# EAGLE design with_usb_small_smd_jmp1 (EAGLE 8.4.2)
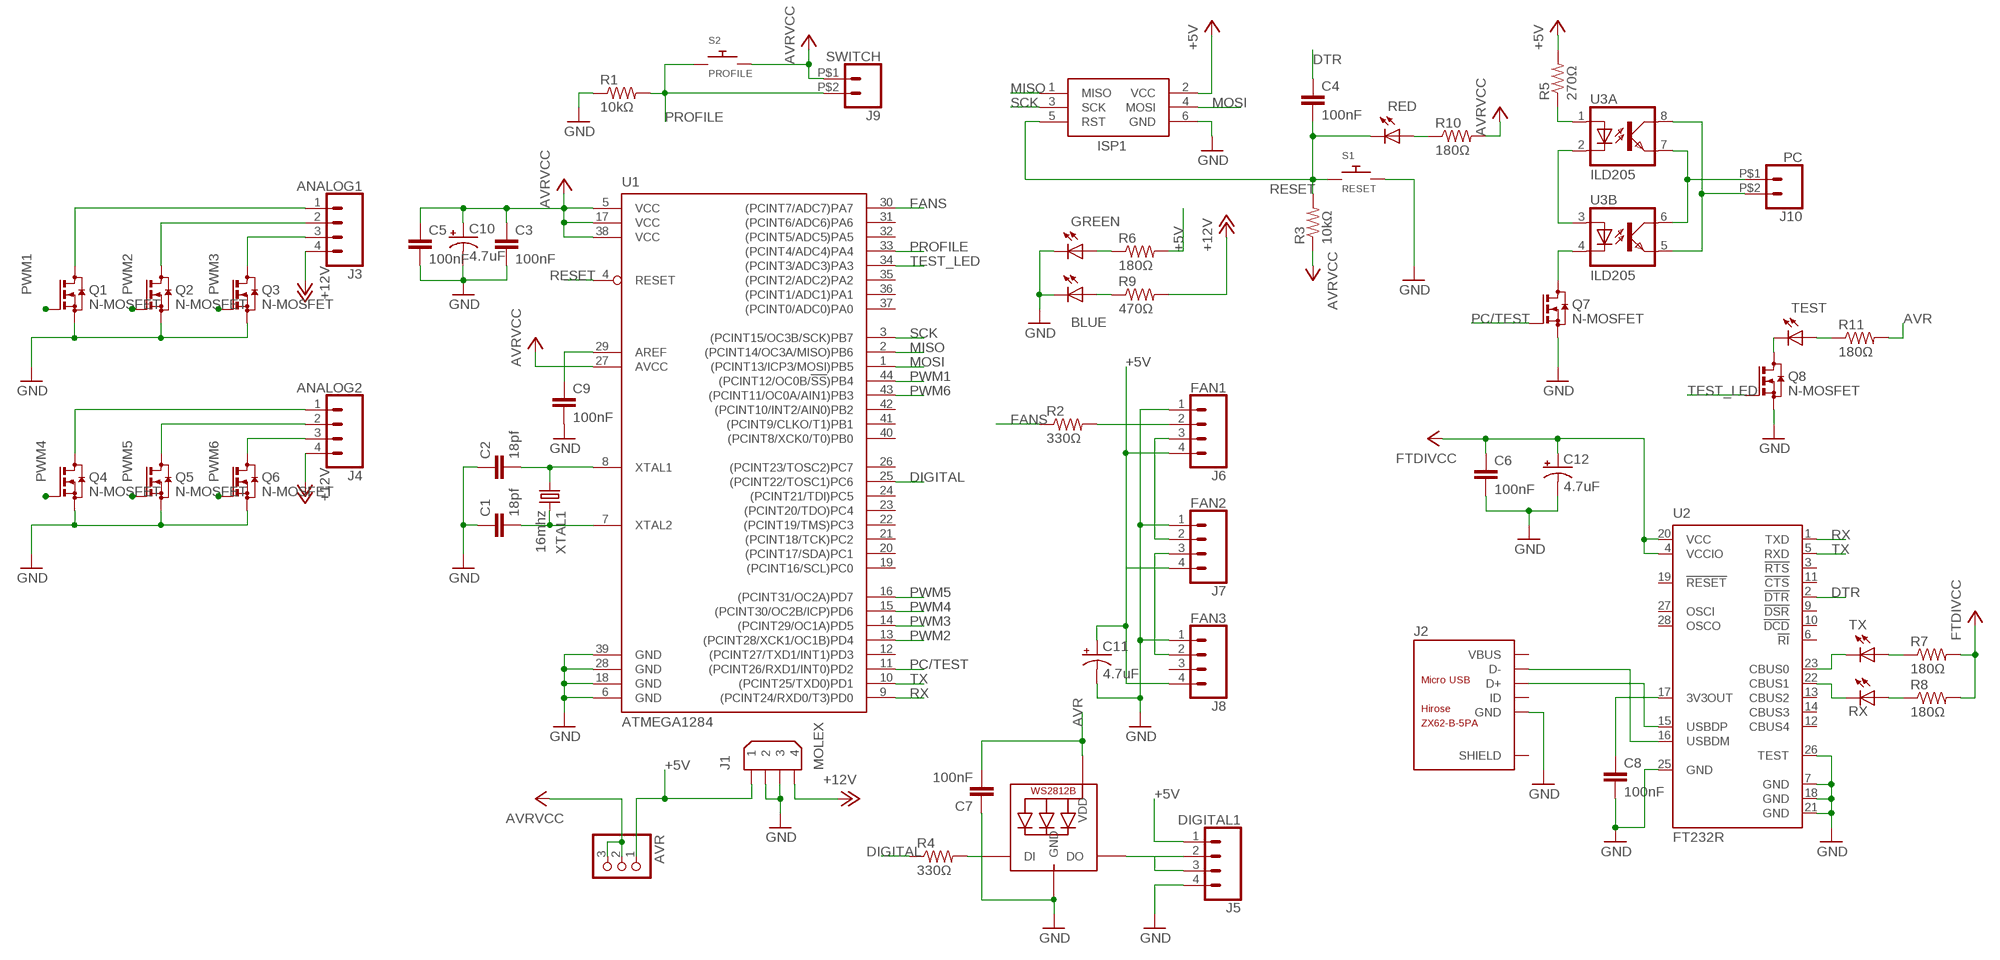
[diagram p0: schematic, sheet 1]

## Parts
AVR  PINHD-1X3  [1X03]
C1  18pf  C-EUC0805  [C0805]
C2  18pf  C-EUC0805  [C0805]
C3  100nF  C-EUC0805  [C0805]
C4  100nF  C-EUC0805  [C0805]
C5  100nF  C-EUC0805  [C0805]
C6  100nF  C-EUC0805  [C0805]
C7  100nF  C-EUC0805  [C0805]
C8  100nF  C-EUC0805  [C0805]
C9  100nF  C-EUC0805  [C0805]
C10  4.7uF  CPOL-US153CLV-0405  [153CLV-0405]
C11  4.7uF  CPOL-US153CLV-0405  [153CLV-0405]
C12  4.7uF  CPOL-US153CLV-0405  [153CLV-0405]
ISP1  AVRISP-6  [AVRISP]
J1  MOLEX  9090-4R  [9090-4R]
J2  MICRO_USB  [MICRO_USB]
J3  ANALOG1  MX-22-05-3041  [MX-22-05-3041]
J4  ANALOG2  MX-22-05-3041  [MX-22-05-3041]
J5  DIGITAL1  MX-22-05-3041  [MX-22-05-3041]
J6  FAN1  TJC8-4P  [TJC8-4P]
J7  FAN2  TJC8-4P  [TJC8-4P]
J8  FAN3  TJC8-4P  [TJC8-4P]
J9  SWITCH  MX-7395-02BG  [MX-7395-02BG]
J10  PC  MX-7395-02BG  [MX-7395-02BG]
LED1  TX  LEDSML0805  [SML0805]
LED2  RX  LEDSML0805  [SML0805]
LED3  GREEN  LEDSML0805  [SML0805]
LED4  BLUE  LEDSML0805  [SML0805]
LED5  RED  LEDSML0805  [SML0805]
LED6  TEST  LEDSML0805  [SML0805]
Q1  N-MOSFET  [SOT23]
Q2  N-MOSFET  [SOT23]
Q3  N-MOSFET  [SOT23]
Q4  N-MOSFET  [SOT23]
Q5  N-MOSFET  [SOT23]
Q6  N-MOSFET  [SOT23]
Q7  N-MOSFET  [SOT23]
Q8  N-MOSFET  [SOT23]
R1  10kΩ  R-US_R0805  [R0805]
R2  330Ω  R-US_R0805  [R0805]
R3  10kΩ  R-US_R0805  [R0805]
R4  330Ω  R-US_R0805  [R0805]
R5  270Ω  R-US_R0805  [R0805]
R6  180Ω  R-US_R0805  [R0805]
R7  180Ω  R-US_R0805  [R0805]
R8  180Ω  R-US_R0805  [R0805]
R9  470Ω  R-US_R0805  [R0805]
R10  180Ω  R-US_R0805  [R0805]
R11  180Ω  R-US_R0805  [R0805]
RGB  WS2812B  [WS2812B]
S1  RESET  BUTTON  [B3F-1000]
S2  PROFILE  BUTTON  [B3F-1000]
U1  ATMEGA1284  ATMEGA1284P-AU  [TQFP44]
U2  FT232R  FT232RL  [SSOP28]
U3  ILD205  [SOIC08]
XTAL1  16mhz  CRYSTALHC49U-V  [HC49U-V]

## Nets
+3V3: C8.1 U2.17(3V3OUT)
+5V: AVR.1 C6.1 C11.+ C12.+ J1.1 J5.1 J6.4 J7.4 J8.4 R5.2 R6.2 R7.2 R8.2 U2.4(VCCIO) U2.20(VCC) ; supply symbol labelled FTDIVCC
+12V: J1.4 J3.4 J4.4 R9.2
AVR: AVR.2 AVR.3 C3.1 C5.1 C7.2 C10.+ ISP1.2(VCC) J9.P$1 R3.1 R10.2 R11.2 RGB.1-VDD(VDD) S2.3 S2.4 U1.5(VCC) U1.17(VCC) U1.27(AVCC) U1.38(VCC) ; supply symbol labelled AVRVCC, +5V
D+: J2.D+ U2.15(USBDP)
D-: J2.D- U2.16(USBDM)
DIGITAL: R4.1 U1.25((PCINT22/TOSC1)PC6)
DIN-D: J5.2 J5.3 RGB.2-DOUT(DO)
DTR: C4.1 U2.2(!DTR)
F1-DIN: J6.2 R2.2
F2-DIN: J6.3 J7.2
F3-DIN: J7.3 J8.2
FANS: R2.1 U1.30((PCINT7/ADC7)PA7)
GND: C1.1 C2.1 C3.2 C5.2 C6.2 C7.1 C8.2 C9.2 C10.- C11.- C12.- ISP1.6(GND) J1.2 J1.3 J2.GND J5.4 J6.1 J7.1 J8.1 LED3.C LED4.C Q1.2(S) Q2.2(S) Q3.2(S) Q4.2(S) Q5.2(S) Q6.2(S) Q7.2(S) Q8.2(S) R1.1 RGB.3-GND(GND) S1.3 S1.4 U1.6(GND) U1.18(GND) U1.28(GND) U1.39(GND) U2.7(GND) U2.18(GND) U2.21(GND) U2.25(GND) U2.26(TEST)
LED-5V: LED3.A R6.1
LED-12V: LED4.A R9.1
LED-IN: R4.2 RGB.4-DIN(DI)
MISO: ISP1.1(MISO) U1.2((PCINT14/OC3A/MISO)PB6)
MOSI: ISP1.4(MOSI) U1.1((PCINT13/ICP3/MOSI)PB5)
N$2: LED1.A R7.1
N$3: LED5.A R10.1
N$4: LED2.A R8.1
N$5: LED6.C Q8.3(D)
N$6: C9.1 U1.29(AREF)
N$7: LED6.A R11.1
N$8: R5.1 U3.1(A:A)
N$11: U3.2(A:C) U3.3(B:A)
N$13: Q7.3(D) U3.4(B:C)
PC1: J10.P$2 U3.5(B:EMIT) U3.8(A:COL)
PC2: J10.P$1 U3.6(B:COL) U3.7(A:EMIT)
PC/TEST: Q7.1(G) U1.11((PCINT26/RXD1/INT0)PD2)
PROFILE: J9.P$2 R1.2 S2.1 S2.2 U1.33((PCINT4/ADC4)PA4)
PWM1: Q1.1(G) U1.44((PCINT12/OC0B/!SS!)PB4)
PWM2: Q2.1(G) U1.13((PCINT28/XCK1/OC1B)PD4)
PWM3: Q3.1(G) U1.14((PCINT29/OC1A)PD5)
PWM4: Q4.1(G) U1.15((PCINT30/OC2B/ICP)PD6)
PWM5: Q5.1(G) U1.16((PCINT31/OC2A)PD7)
PWM6: Q6.1(G) U1.43((PCINT11/OC0A/AIN1)PB3)
RESET: C4.2 ISP1.5(RST) LED5.C R3.2 S1.1 S1.2 U1.4(RESET)
RX: U1.9((PCINT24/RXD0/T3)PD0) U2.1(TXD)
RXLED: LED2.C U2.22(CBUS1)
S1-1: J3.1 Q1.3(D)
S1-2: J3.2 Q2.3(D)
S1-3: J3.3 Q3.3(D)
S2-1: J4.1 Q4.3(D)
S2-2: J4.2 Q5.3(D)
S2-3: J4.3 Q6.3(D)
SCK: ISP1.3(SCK) U1.3((PCINT15/OC3B/SCK)PB7)
TEST_LED: Q8.1(G) U1.34((PCINT3/ADC3)PA3)
TX: U1.10((PCINT25/TXD0)PD1) U2.5(RXD)
TXLED: LED1.C U2.23(CBUS0)
XTAL1: C2.2 U1.8(XTAL1) XTAL1.1
XTAL2: C1.2 U1.7(XTAL2) XTAL1.2
Unconnected: J2.ID J2.S1(SHIELD) J2.S2(SHIELD) J2.VCC(VBUS) J8.3 U1.12((PCINT27/TXD1/INT1)PD3) U1.19((PCINT16/SCL)PC0) U1.20((PCINT17/SDA)PC1) U1.21((PCINT18/TCK)PC2) U1.22((PCINT19/TMS)PC3) U1.23((PCINT20/TDO)PC4) U1.24((PCINT21/TDI)PC5) U1.26((PCINT23/TOSC2)PC7) U1.31((PCINT6/ADC6)PA6) U1.32((PCINT5/ADC5)PA5) U1.35((PCINT2/ADC2)PA2) U1.36((PCINT1/ADC1)PA1) U1.37((PCINT0/ADC0)PA0) U1.40((PCINT8/XCK0/T0)PB0) U1.41((PCINT9/CLKO/T1)PB1) U1.42((PCINT10/INT2/AIN0)PB2) U2.3(!RTS) U2.6(!RI) U2.9(!DSR) U2.10(!DCD) U2.11(!CTS) U2.12(CBUS4) U2.13(CBUS2) U2.14(CBUS3) U2.19(!RESET) U2.27(OSCI) U2.28(OSCO)

## Library data of the parts
AVR = my_parts:PINHD-1X3: PIN HEADER
C1 C4 = rcl:C-EU: CAPACITOR, European symbol
C2 C3 C5-C9 = resistor:C-EU: CAPACITOR, European symbol; SPICEPREFIX: C
C10-C12 = resistor:CPOL-US: POLARIZED CAPACITOR, American symbol; SPICEPREFIX: C
ISP1 = my_parts:AVRISP: AVR ISP HEADER Standard 6 pin header for AVR programming; SPICEPREFIX: X
J1 = con-thomas-betts:9090-4: Disk Drive Power four position Source: Thomas & Betts Electronic Interconnects Eiropean Edition 1998; OC_FARNELL: unknown; OC_NEWARK: unknown
J2 = my_parts:MICRO_USB
J3-J5 = my_parts:MX-22-05-3041
J6 = my_parts:TJC8-4P; SPICEPREFIX: X
J7 J8 = my_parts:TJC8-4P
J9 J10 = my_parts:MX-7395-02BG
LED1-LED6 = led:LED: LED OSRAM: - CHIPLED LG R971, LG N971, LY N971, LG Q971, LY Q971, LO R971, LY R971 LH N974, LH R974 LS Q976, LO Q976, LY Q976 LO Q996 - Hyper CHIPLED LW Q18S LB Q993, LB Q99A, LB R99A - SideLED LS A670, LO A670, LY A670, LG A670, LP A670 LB A673, LV A673, LT A673, LW A673 LH A674 LY A675 LS A676, LA A676, LO A676, LY A676, LW A676 LS A679, LY A679, LG A679 - Hyper Micro SIDELED® LS Y876, LA Y876, LO Y876, LY Y876 LT Y87S - SmartLED LW L88C, LW L88S LB L89C, LB L89S, LG L890 LS L89K, LO L89K, LY L89K LS L896, LA L896, LO L896, LY L896 - TOPLED LS T670, LO T670, LY T670, LG T670, LP T670 LSG T670, LSP T670, LSY T670, LOP T670, LYG T670 LG T671, LOG T671, LSG T671 LB T673, LV T673, LT T673, LW T673 LH T674 LS T676, LA T676, LO T676, LY T676, LB T676, LH T676, LSB T676, LW T676 LB T67C, LV T67C, LT T67C, LS T67K, LO T67K, LY T67K, LW E67C LS E67B, LA E67B, LO E67B, LY E67B, LB E67C, LV E67C, LT E67C LW T67C LS T679, LY T679, LG T679 LS T770, LO T770, LY T770, LG T770, LP T770 LB T773, LV T773, LT T773, LW T773 LH T774 LS E675, LA E675, LY E675, LS T675 LS T776, LA T776, LO T776, LY T776, LB T776 LHGB T686 LT T68C, LB T68C - Hyper Mini TOPLED® LB M676 - Mini TOPLED Santana® LG M470 LS M47K, LO M47K, LY M47K Source: http://www.osram.convergy.de LUXEON: - LUMILED® LXK2-PW12-R00, LXK2-PW12-S00, LXK2-PW14-U00, LXK2-PW14-V00 LXK2-PM12-R00, LXK2-PM12-S00, LXK2-PM14-U00 LXK2-PE12-Q00, LXK2-PE12-R00, LXK2-PE12-S00, LXK2-PE14-T00, LXK2-PE14-U00 LXK2-PB12-K00, LXK2-PB12-L00, LXK2-PB12-M00, LXK2-PB14-N00, LXK2-PB14-P00, LXK2-PB14-Q00 LXK2-PR12-L00, LXK2-PR12-M00, LXK2-PR14-Q00, LXK2-PR14-R00 LXK2-PD12-Q00, LXK2-PD12-R00, LXK2-PD12-S00 LXK2-PH12-R00, LXK2-PH12-S00 LXK2-PL12-P00, LXK2-PL12-Q00, LXK2-PL12-R00 Source: www.luxeon.com KINGBRIGHT: KA-3528ASYC Source: www.kingbright.com
Q1 Q4-Q8 = my_parts:N-MOSFET
Q2 = my_parts:N-MOSFET; SPICEPREFIX: Q
Q3 = my_parts:N-MOSFET; SPICEPREFIX: M
R1-R11 = resistor:R-US_: RESISTOR, American symbol; SPICEPREFIX: R
RGB = my_parts:WS2812B
S1 = my_parts:BUTTON; SPICEPREFIX: B
S2 = my_parts:BUTTON
U1 = my_parts:ATMEGA1284P-AU; SPICEPREFIX: X
U2 = ftdichip:FT232R: Source: http://www.ftdichip.com/Documents/DataSheets/DS_FT232R_v104.pdf; MPN: FT232RL; OC_FARNELL: 1146032; OC_NEWARK: 91K9918
U3 = optocoupler:ILD2*: Siemens ILD205/206/207/211/213/217 DUAL PHOTOTRANSISTOR SMALL OUTLINE SURFACE MOUNT OPTOCOUPLER Source: 153385-da-01-en-Optocoupler_ILD205-T.pdf; MF: VISHAY/TELEFUNKEN; MPN: ILD205T; OC_FARNELL: 1469512; OC_NEWARK: 20H8678; SPICEPREFIX: O
XTAL1 = adafruit:CRYSTAL: CRYSTAL; OC_FARNELL: 1666969; OC_NEWARK: unknown; SPICEPREFIX: X

## Net classes
0 default: clearance 0.152 mm
1 GND: clearance 0.61 mm

## Board
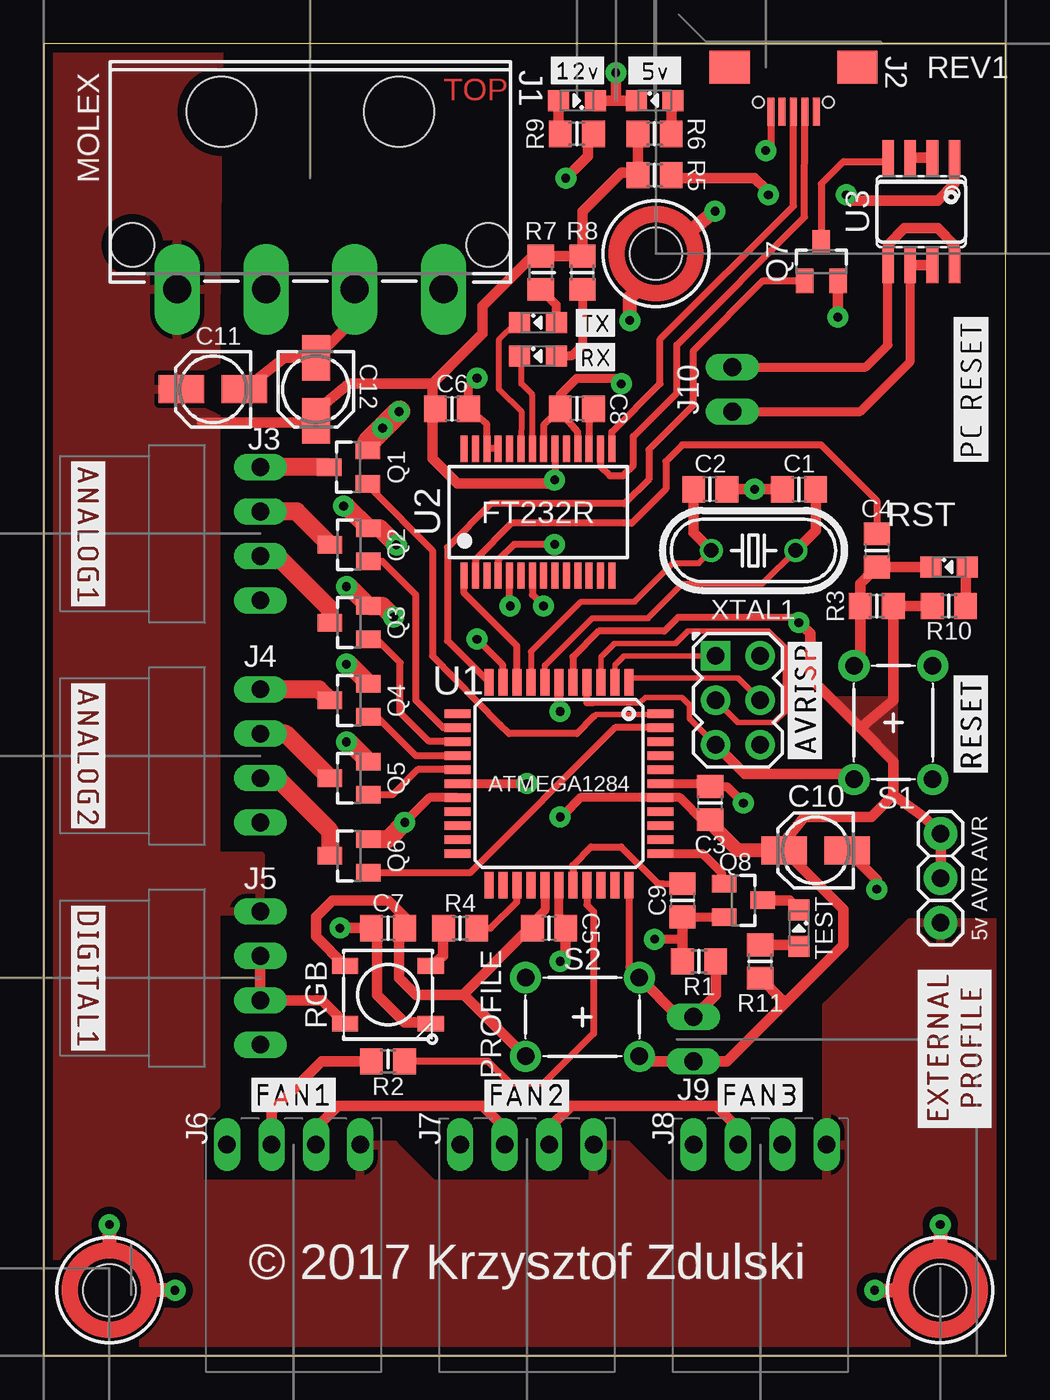
[diagram p1: board, top side]
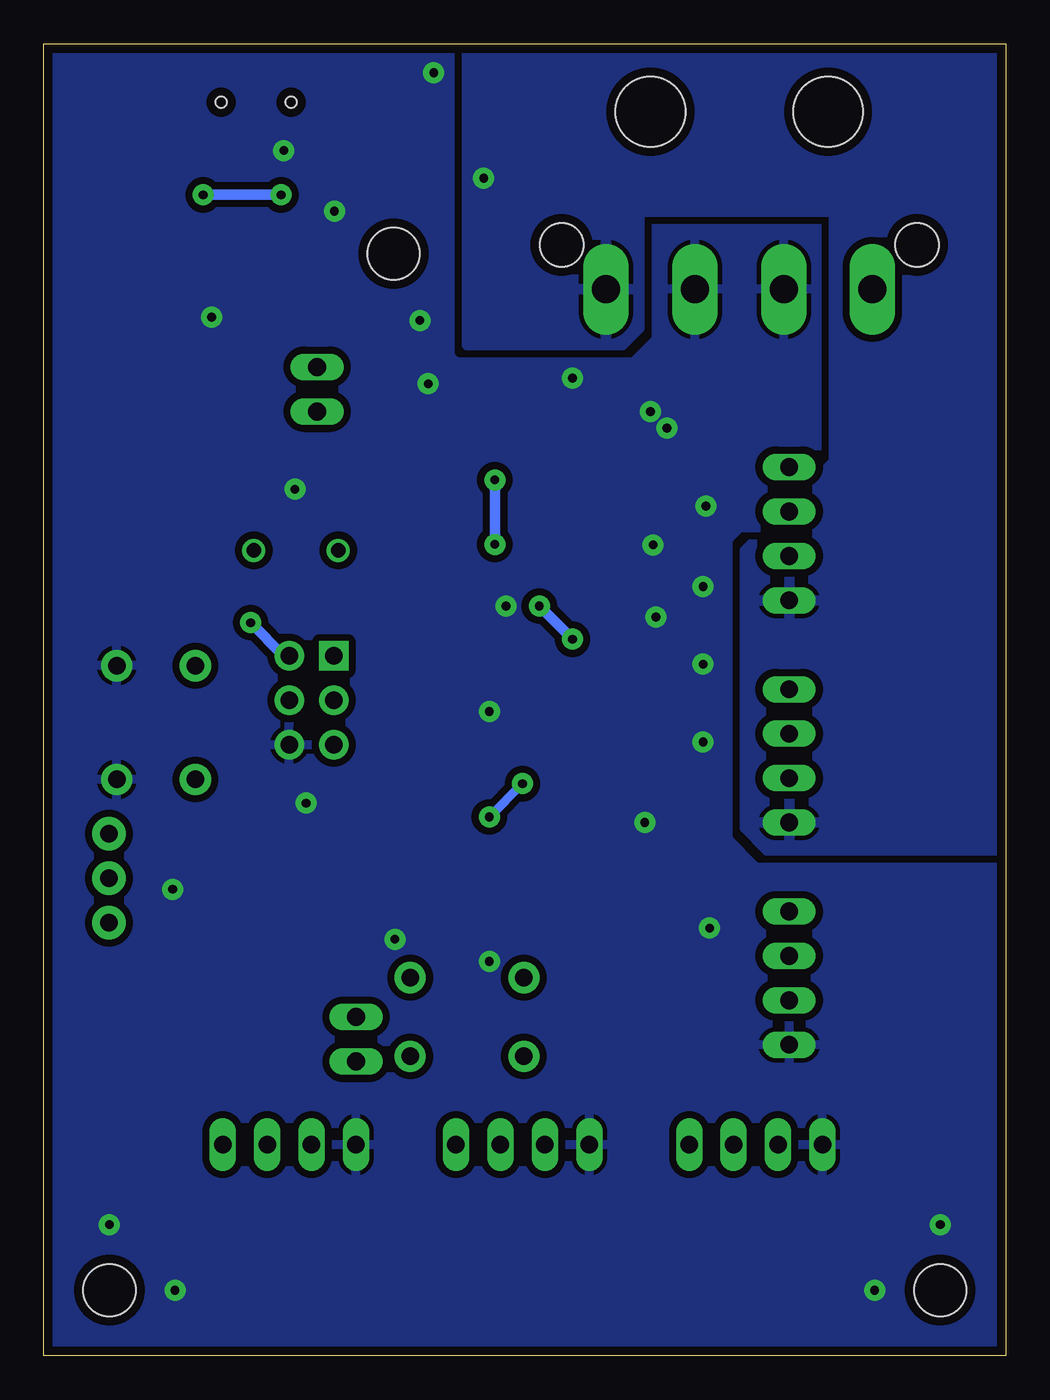
[diagram p2: board, bottom side, seen from below]

Size 55 x 75 mm. Coordinates in mm from the lower left corner, seen from the top.
Outline: 0,0 55,0 55,75 0,75 0,0
Copper layers (1*16): Top 0.035mm / dielectric 1.5mm / Bottom 0.035mm
Design rules "default *": minimum track width 6mil, minimum drill 0.5mm, track to track 8mil, track to pad 8mil, pad to pad 8mil, via to via 8mil, smd to smd 6mil, copper to edge 20mil, drill to drill 6mil, minimum pad ring 10mil, minimum via ring 4mil, stop-mask expansion 3mil, vias tented up to drill 3mm, thermal gap 10mil
Holes 3 mm at 3.75,3.75 51.25,3.75 35,63
tRestrict: area 9.5,54.3 to 10.2,56.2; area 1.2,1.2 to 6.2,6.2; area 48.8,1.2 to 53.8,6.2; area 32.5,60.5 to 37.5,65.5

### Footprints (pad centres in the part's own frame; a part is rotated, then mirrored left to right if it is on the bottom)
1X03 = drill 1 pad 1.905: 1 -2.54,0; 2 0,0; 3 2.54,0
C0805 = smd 1.3 x 1.5: 1 -0.95,0; 2 0.95,0
153CLV-0405 = smd 2.6 x 1.6: + 1.8,0; - -1.8,0
AVRISP = drill 1 pad 1.676 square: 1 -1.27,2.54 | drill 1 pad 1.676: 2 1.27,2.54; 3 -1.27,0; 4 1.27,0; 5 -1.27,-2.54; 6 1.27,-2.54
9090-4R = drill 1.6 pad 2.6 long: 1 -7.62,-6.35; 2 -2.54,-6.35; 3 2.54,-6.35; 4 7.62,-6.35 | hole 4: -5.08,3.81; 5.08,3.81 | hole 2.5: -10.16,-3.81; 10.16,-3.81
MICRO_USB = smd 0.4 x 1.6: D+ 0,2.55; D- -0.65,2.55; GND 1.3,2.55; ID 0.65,2.55; VCC -1.3,2.55 | smd 2.3 x 1.9: S1 -3.65,0; S2 3.65,0 | hole 0.65: -2,2; 2,2
MX-22-05-3041 = drill 1.016 long: 1 3.81,0; 2 1.27,0; 3 -1.27,0; 4 -3.81,0
TJC8-4P = drill 1 long: 1 3.81,0; 2 1.27,0; 3 -1.27,0; 4 -3.81,0
MX-7395-02BG = drill 1.016 long: P$1 -1.27,0; P$2 1.27,0
SML0805 = smd 1.2 x 1.2: A 1.05,0; C -1.05,0
SOT23 = smd 1 x 1.4: 1 -0.95,-1.1; 2 0.95,-1.1; 3 0,1.1
R0805 = smd 1.3 x 1.5: 1 -0.95,0; 2 0.95,0
WS2812B = smd 1.5 x 0.9: 1-VDD 2.45,-1.65; 2-DOUT 2.45,1.65; 3-GND -2.45,1.65; 4-DIN -2.45,-1.65
B3F-1000 = drill 1 pad 1.778: 1 -3.25,2.25; 2 3.25,2.25; 3 -3.25,-2.25; 4 3.25,-2.25
TQFP44 = smd 1.5 x 0.5: 1 -5.8,4; 2 -5.8,3.2; 3 -5.8,2.4; 4 -5.8,1.6; 5 -5.8,0.8; 6 -5.8,0; 7 -5.8,-0.8; 8 -5.8,-1.6; 9 -5.8,-2.4; 10 -5.8,-3.2; 11 -5.8,-4; 23 5.8,-4; 24 5.8,-3.2; 25 5.8,-2.4; 26 5.8,-1.6; 27 5.8,-0.8; 28 5.8,0; 29 5.8,0.8; 30 5.8,1.6; 31 5.8,2.4; 32 5.8,3.2; 33 5.8,4 | smd 0.5 x 1.5: 12 -4,-5.8; 13 -3.2,-5.8; 14 -2.4,-5.8; 15 -1.6,-5.8; 16 -0.8,-5.8; 17 0,-5.8; 18 0.8,-5.8; 19 1.6,-5.8; 20 2.4,-5.8; 21 3.2,-5.8; 22 4,-5.8; 34 4,5.8; 35 3.2,5.8; 36 2.4,5.8; 37 1.6,5.8; 38 0.8,5.8; 39 0,5.8; 40 -0.8,5.8; 41 -1.6,5.8; 42 -2.4,5.8; 43 -3.2,5.8; 44 -4,5.8
SSOP28 = smd 0.4 x 1.5: 1 -4.225,-3.625; 2 -3.575,-3.625; 3 -2.925,-3.625; 4 -2.275,-3.625; 5 -1.625,-3.625; 6 -0.975,-3.625; 7 -0.325,-3.625; 8 0.325,-3.625; 9 0.975,-3.625; 10 1.625,-3.625; 11 2.275,-3.625; 12 2.925,-3.625; 13 3.575,-3.625; 14 4.225,-3.625; 15 4.225,3.625; 16 3.575,3.625; 17 2.925,3.625; 18 2.275,3.625; 19 1.625,3.625; 20 0.975,3.625; 21 0.325,3.625; 22 -0.325,3.625; 23 -0.975,3.625; 24 -1.625,3.625; 25 -2.275,3.625; 26 -2.925,3.625; 27 -3.575,3.625; 28 -4.225,3.625
SOIC08 = smd 0.66 x 2.032: 1 -1.905,-3.073; 2 -0.635,-3.073; 3 0.635,-3.073; 4 1.905,-3.073; 5 1.905,3.073; 6 0.635,3.073; 7 -0.635,3.073; 8 -1.905,3.073
HC49U-V = drill 0.813: 1 -2.413,0; 2 2.413,0

### Placement (x,y rotation side)
AVR  51.28,27.3 90 top
C1  43.18,49.53 0 top
C2  38.1,49.53 180 top
C3  38.1,31.59 90 top
C4  47.62,46.04 270 top
C5  28.89,24.45 0 top
C6  23.34,54.13 0 top
C7  19.68,24.45 0 top
C8  30.48,54.13 180 top
C9  36.51,26.04 270 top
C10  44.13,28.89 180 top
C11  9.68,55.24 180 top
C12  15.56,55.24 270 top
ISP1  39.69,37.47 0 top
J1  15.24,67.31 0 top
J2  42.86,73.66 180 top
J3  12.38,46.99 90 top
J4  12.38,34.29 90 top
J5  12.38,21.59 90 top
J6  14.29,12.06 180 top
J7  27.62,12.06 180 top
J8  40.96,12.06 180 top
J9  37.15,18.1 90 top
J10  39.37,55.24 90 top
LED1  28.26,59.05 0 top
LED2  28.26,57.15 0 top
LED3  34.92,71.75 0 top
LED4  30.48,71.75 180 top
LED5  51.75,45.09 0 top
LED6  43.18,24.45 270 top
Q1  17.41,50.8 90 top
Q2  17.46,46.35 90 top
Q3  17.46,41.91 90 top
Q4  17.46,37.47 90 top
Q5  17.46,33.02 90 top
Q6  17.46,28.57 90 top
Q7  44.45,62.55 0 top
Q8  40.01,26.04 270 top
R1  37.47,22.54 0 top
R2  19.68,16.83 180 top
R3  47.62,42.86 180 top
R4  23.81,24.45 180 top
R5  34.92,67.49 180 top
R6  34.92,69.85 180 top
R7  28.42,61.91 90 top
R8  30.8,61.91 90 top
R9  30.48,69.85 0 top
R10  51.75,42.86 180 top
R11  40.96,22.54 270 top
RGB  19.68,20.64 180 top
S1  48.58,36.2 90 top
S2  30.8,19.37 0 top
U1  29.45,32.7 270 top
U2  28.26,48.22 0 top
U3  50.16,65.41 180 top
XTAL1  40.58,46.04 0 top

### Tracks (layer width: path | path; a pad name or v marks a point on that pad's centre or on a via)
+3V3
  Top 0.406: C8.1 31.18,54.05 U2.17
+5V  (via drill 0.5 pad 1.2)
  Top 0.406: U2.4 25.98,45.47 26.89,46.38 v29.21,46.38 | 29.23,51.87 U2.20 29.23,50.25 v29.21,50.07
  Top 0.61: v29.21,50.07 28.99,49.85 23.65,49.85 22.23,51.28 22.23,54.13 | 33.98,67.63 R6.2 | 33.98,67.63 R5.2 | 22.23,55.56 25.08,58.42 25.08,60.01 26.99,61.91 27.94,62.87 R7.2 R8.2 30.8,65.41 33.02,67.63 33.98,67.63 | 22.23,54.13 22.23,55.56 | C6.1 22.23,54.13 | 22.23,55.56 17.46,55.56 15.66,54.08 C12.+ 15.35,53.45 14.92,53.34 9.05,53.34
  Bottom 0.61: v29.21,50.07 v29.21,46.38
  pour Top (isolate 0.406): 0,0 0,75 10,75 9.84,59.37 9.84,28.57 12.38,28.57 12.38,25.4 9.84,25.4 9.84,14.29 8.89,13.34 8.89,9.84 18.1,9.84 18.1,12.06 20,12.06 22.23,9.84 31.43,9.84 31.43,12.06 33.34,12.06 35.56,9.84 44.77,9.84 44.77,20 49.53,24.77 54.93,24.77 55,0
+12V  (via drill 0.5 pad 1.2)
  Top 0.61: R9.2 31.11,69.53 31.11,68.58 v29.84,67.31
  pour Bottom (isolate 0.406): 0,28.89 13.65,28.89 14.92,30.16 14.92,46.04 9.84,51.12 9.84,65.41 20.95,65.41 20.95,58.74 21.91,57.78 30.8,57.78 30.8,68.9 30.79,75 0,75
AVR  (via drill 0.5 pad 1.2)
  Top 0.406: v43.18,41.91 42.87,42.22 36.28,42.22 35.48,41.42 31.72,41.42 30.25,39.95 U1.5 | 28.7,26.95 U1.27
  Top 0.508: U1.27 28.65,25.48 28.26,25.08 28.26,24.45 C5.1 | U1.17 v27.62,32.7 | v29.53,30.8 29.79,31.01 30.68,31.9 U1.38 36.36,31.9 37.78,30.48 38.1,30.48 C3.1 | 42.12,29.1 C10.+ | 20.32,24.13 C7.2 | 24.03,20.64 24.03,20.69
  Top 0.61: v43.18,41.91 43.81,41.27 43.81,38.73 46.67,35.88 | 46.67,35.88 48.58,33.97 48.58,32.07 | 48.58,32.07 47.31,30.8 43.5,30.8 42.12,29.1 | AVR.2 AVR.3 50.32,30.8 48.58,32.07 | 20.32,24.13 20.32,21.59 21.27,20.64 24.03,20.64 S2.3 | C7.2 20.64,25.09 19.68,26.04 16.51,26.04 15.56,25.08 15.56,23.96 RGB.1-VDD | S2.4 34.34,16.83 J9.P$1 39.05,16.83 42.55,20.32 | C5.1 27.46,24.13 24.03,20.69 | 46.67,35.88 48.58,37.47 R3.1 R10.2 | C10.+ 45.72,25.5 45.72,23.5 42.55,20.32 | R11.2 42.23,20.32 42.55,20.32
  Top 0.813: 42.55,28.68 C10.+ 39.69,28.89 38.1,30.48
  Bottom 0.508: v27.62,32.7 v29.53,30.8
  Bottom 0.61: v43.18,41.91 41.27,40.01 ISP1.2
  pour Top: 45.09,37.47 48.58,37.47 48.58,33.97
D+
  Top 0.406: J2.D+ 42.86,65.72 35.24,58.1 35.24,55.56 32.48,52.8 U2.15
D-
  Top 0.406: U2.16 31.83,50.83 32.36,50.3 33.12,50.3 33.71,50.9 33.71,52.55 36.2,55.03 36.2,57.78 43.5,65.09 J2.D-
DIGITAL
  Top 0.406: U1.25 27.05,25.94 25.56,24.45 R4.1
DIN-D
  Top 0.61: J5.2 J5.3 15.9,20.32 RGB.2-DOUT
DTR
  Top 0.406: U2.2 24.68,45.53 26.75,47.59 33.62,47.59 35.56,49.53 35.56,51.12 36.51,52.07 44.45,52.07 47.62,48.89 C4.1
F1-DIN
  Top 0.61: R2.2 15.88,16.83 13.02,13.97 J6.2
F2-DIN
  Top 0.61: J6.3 15.56,13.02 16.83,14.29 25.08,14.29 26.35,13.02 J7.2
F3-DIN
  Top 0.61: J7.3 28.89,13.02 30.16,14.29 38.42,14.29 39.69,13.02 J8.2
FANS
  Top 0.406: R2.1 25.41,16.83 26.68,15.56 28.57,15.56 31.43,18.41 31.43,25.4 31.05,25.78 U1.30
GND  (via drill 0.5 pad 1.2)
  Top 0.406: U2.7 27.93,43.51 v28.57,42.86 | U2.18 30.53,52.81 29.53,53.97 C8.2 28.58,53.19 U2.21 | v41.27,68.9 41.56,69.19 J2.GND | C6.2 25.31,53.27 25.33,53.25 U2.26 U2.25
  Top 0.508: U1.6 29.45,36.91 v29.53,36.83 | U1.18 22.06,31.9 v20.64,30.48 | U1.39 38.1,32.7 C3.2 39.05,32.54 v40.01,31.59 | U1.28 29.45,24.52 C5.2 | C9.2 Q8.2 | 36.51,23.81 v34.92,23.81 | C6.2 24.29,55.4 v24.77,55.88 | C8.2 29.53,54.93 30.48,55.88 32.7,55.88 v33.02,55.56
  Top 0.61: 32.7,71.75 LED4.C | C11.- 13.76,57.05 C12.- 17.78,59.27 J1.3 | C5.2 29.84,22.86 v29.53,22.54 | C10.- 47.62,27.2 v47.62,26.67 | C2.1 v40.64,49.53 C1.1 | C9.2 36.51,23.81 36.51,22.86 R1.1 | RGB.3-GND 22.07,19.05 20.64,19.05 19.05,20.64 19.05,24.45 C7.1 v16.93,24.45 | 32.7,71.75 v32.7,73.34 | LED3.C 32.7,71.75 | Q7.2 v45.4,59.38 v45.4,59.37
  Top 0.813: Q6.2 18.41,29.53 | v3.75,7.5 3.75,6.43 | v7.5,3.75 6.43,3.75 | v47.5,3.75 48.57,3.75 | v51.25,7.5 51.25,6.43 | v38.38,65.43 36.88,64.24 | v33.5,59.18 33.5,60.5 34,61
  Top 1.016: 18.73,42.86 Q3.2 | Q5.2 17.45,35.08 v17.3,35.08 | Q4.2 17.45,39.53 v17.3,39.53 | Q3.2 17.45,43.97 v17.3,43.97 | v17.14,48.58 17.29,48.58 Q2.2 19.21,47.3 v20.16,46.35 | v20.64,30.48 19.68,29.52 Q6.2 | Q3.2 19.37,42.86 v20,42.23 | Q1.2 18.52,52.17
  Top 1.27: 18.52,52.17 v19.37,53.02 v20.32,53.98
  pour Bottom (isolate 0.406, rank 2): 0,75 55,75 55,0 0,0
LED-5V
  Top 0.61: LED3.A 35.88,71.66 R6.1
LED-12V
  Top 0.61: 29.21,71.54 LED4.A 29.43,69.75 R9.1
LED-IN
  Top 0.61: R4.2 22.83,22.86 RGB.4-DIN
MISO
  Top 0.305: U1.2 32.65,39.49 33.16,40 38.26,40 ISP1.1
MOSI
  Top 0.305: ISP1.4 39.68,38.74 33.63,38.74 U1.1
N$1
  pour Bottom (rank 2): 11.15,9.53 46.35,9.53 46.04,0.5 11.11,0.51
N$2
  Top 0.508: LED1.A 29.31,60.07 R7.1
N$3
  Top 0.61: LED5.A 52.7,44.98 R10.1
N$4
  Top 0.508: R8.1 30.8,57.78 30.16,57.15 LED2.A
N$5
  Top 0.61: Q8.3 42.64,26.04 LED6.C
N$6
  Top 0.406: U1.29 30.25,28.04 31.3,29.09 33.01,29.09 35.11,26.99 35.42,26.99 C9.1
N$7
  Top 0.61: R11.1 43.09,23.49 LED6.A
N$8  (via drill 0.5 pad 1.2)
  Top 0.61: R5.1 36.51,67.31 40.64,67.31 41.27,66.67 v41.43,66.36 | v45.88,66.36 46.2,66.04 51.12,66.04 52.07,66.99 U3.1
  Bottom 0.61: v41.43,66.36 v45.88,66.36
N$11
  Top 0.61: U3.3 U3.2
N$13
  Top 0.406: U3.4 48.04,68.26 45.72,68.26 44.45,66.99 Q7.3
PC1
  Top 0.508: J10.P$2 46.99,56.52 48.26,57.78 U3.5
  Top 0.61: U3.8 52.07,63.5 51.12,64.45 49.21,64.45 48.26,63.5 U3.5
PC2
  Top 0.508: J10.P$1 46.67,53.98 49.53,56.83 U3.6
  Top 0.61: U3.6 U3.7
PC/TEST
  Top 0.406: U1.11 23.08,40.88 23.08,46.21 25.57,48.7 33.2,48.7 34.59,50.09 34.59,51.79 37.15,54.35 37.15,57.47 41.13,61.45 Q7.1 43.33,61.28
PROFILE
  Top 0.406: U1.33 33.45,22.21 S2.2
  Top 0.508: 36.3,19.37 J9.P$2
  Top 0.61: R1.2 38.42,20.64 J9.P$2 | S2.2 36.3,19.37
PWM1
  Top 0.305: 31.46,36.56 31.57,36.67 35.25,36.67 U1.44
  Top 0.406: 31.46,36.56 30.48,35.56 26.61,35.56 26.1,36.07 22.23,40.01 22.23,46.04 18.73,49.53 Q1.1
PWM2
  Top 0.406: 23.62,35.88 U1.13 22.84,35.9 21.27,37.47 21.27,43.5 19.36,45.41 Q2.1
PWM3
  Top 0.406: Q3.1 19.2,40.81 20.38,39.62 20.38,36.77 22.04,35.12 23.64,35.12 U1.14
PWM4
  Top 0.406: U1.15 23.64,34.29 21.27,34.29 19.05,36.52 Q4.1
PWM5
  Top 0.406: 23.61,33.47 U1.16 21.37,33.5 19.94,32.07 Q5.1
PWM6
  Top 0.406: Q6.1 24.39,27.62 32.67,35.9 U1.43
RESET
  Top 0.305: ISP1.5 36.92,36.42 36.92,37.2 36.47,37.64 34.41,37.64 34.05,37.31 31.75,37.31 31.41,37.33
  Top 0.406: U1.4 31.05,37.33 31.41,37.33
  Top 0.61: ISP1.5 40.08,33.26 46.01,33.26 S1.1 | 50.8,44.87 LED5.C 50.8,45.19 50.01,45.09 48.74,45.09 C4.2 46.67,44.14 R3.2 46.67,39.79 S1.2
RX
  Top 0.406: U2.1 24.03,43.59 27.05,40.58 U1.9
RXLED
  Top 0.305: 27.3,57.05 LED2.C
  Top 0.356: U2.22 27.93,54.94 27.3,55.56 27.3,57.05
S1-1
  Top 1.016: Q1.3 J3.1
S1-2
  Top 1.016: Q2.3 14.46,48.26 J3.2
S1-3
  Top 1.016: Q3.3 16.36,42.69 13.34,45.72 J3.3
S2-1
  Top 1.016: Q4.3 15.73,38.1 J4.1
S2-2
  Top 1.016: Q5.3 13.82,35.56 J4.2
S2-3
  Top 1.016: J4.3 13.34,33.02 16.36,29.99 Q6.3
SCK
  Top 0.305: ISP1.3 39.69,36.2 41.75,36.2 42.39,36.83 42.39,40.48 41.43,41.43 36.83,41.43 36.1,40.71 32.63,40.71 31.85,39.93 U1.3
TEST_LED
  Top 0.508: U1.34 37.66,28.7 38.73,27.62 38.73,27.3 Q8.1
TX  (via drill 0.5 pad 1.2)
  Top 0.406: U1.10 26.25,39.47 v24.77,40.96 | v26.67,42.86 26.63,43.22 U2.5
  Bottom 0.61: v24.77,40.96 v26.67,42.86
TXLED
  Top 0.305: LED1.C 26.99,59.05
  Top 0.356: 26.99,59.05 26.01,58.08 26.01,55.27 27.3,53.98 U2.23
XTAL1
  Top 0.356: U1.8 27.85,40.24 30.72,43.11 33.78,43.11 35.97,45.31 37.43,45.31 XTAL1.1
  Top 0.61: XTAL1.1 37.15,47.05 C2.2
XTAL2
  Top 0.356: U1.7 28.65,39.46 31.36,42.17 34.55,42.17 36.51,44.13 41.08,44.13 XTAL1.2
  Top 0.61: C1.2 44.13,47.18 XTAL1.2
(copper drawn outside any net)
  shapes: Top circle x3

### Text on the board
Top: TOP
bRestrict: LED Controller | by RouNdeL
_tplace: REV1 | RST | 5v AVR AVR | © 2017 Krzysztof Zdulski